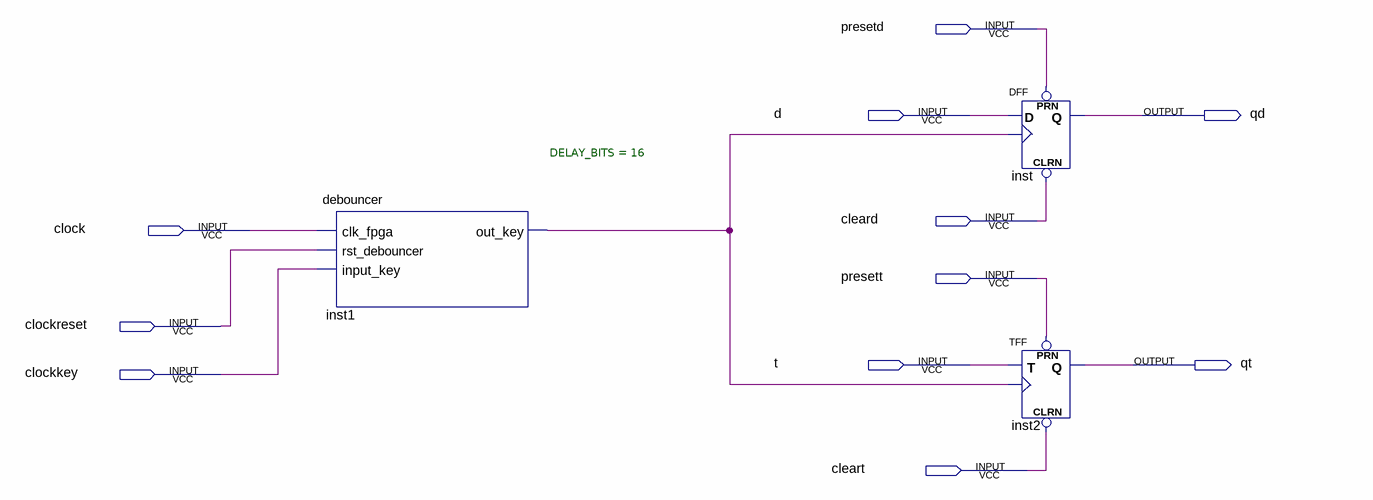
[diagram p0: schematic sheet]
// Quartus schematic flipFlops.bdf as structural Verilog: 3 symbols, 11 pins
module flipFlops (
  input  presetd,
  input  d,
  input  cleard,
  input  clock,
  input  presett,
  input  clockreset,
  input  t,
  input  clockkey,
  input  cleart,
  output qd,
  output qt
);

  wire inst1_out_key;

  debouncer #(.DELAY_BITS(16)) inst1 (
    .clk_fpga(clock), .rst_debouncer(clockreset), .input_key(clockkey), .out_key(inst1_out_key));
  DFF inst (.CLRN(cleard), .CLK(inst1_out_key), .D(d), .PRN(presetd), .Q(qd));
  TFF inst2 (.PRN(presett), .CLRN(cleart), .T(t), .CLK(inst1_out_key), .Q(qt));
endmodule
